# EAGLE design MTB-v2.0.0 (EAGLE 7.7.0)

## Sheet 1 of 3
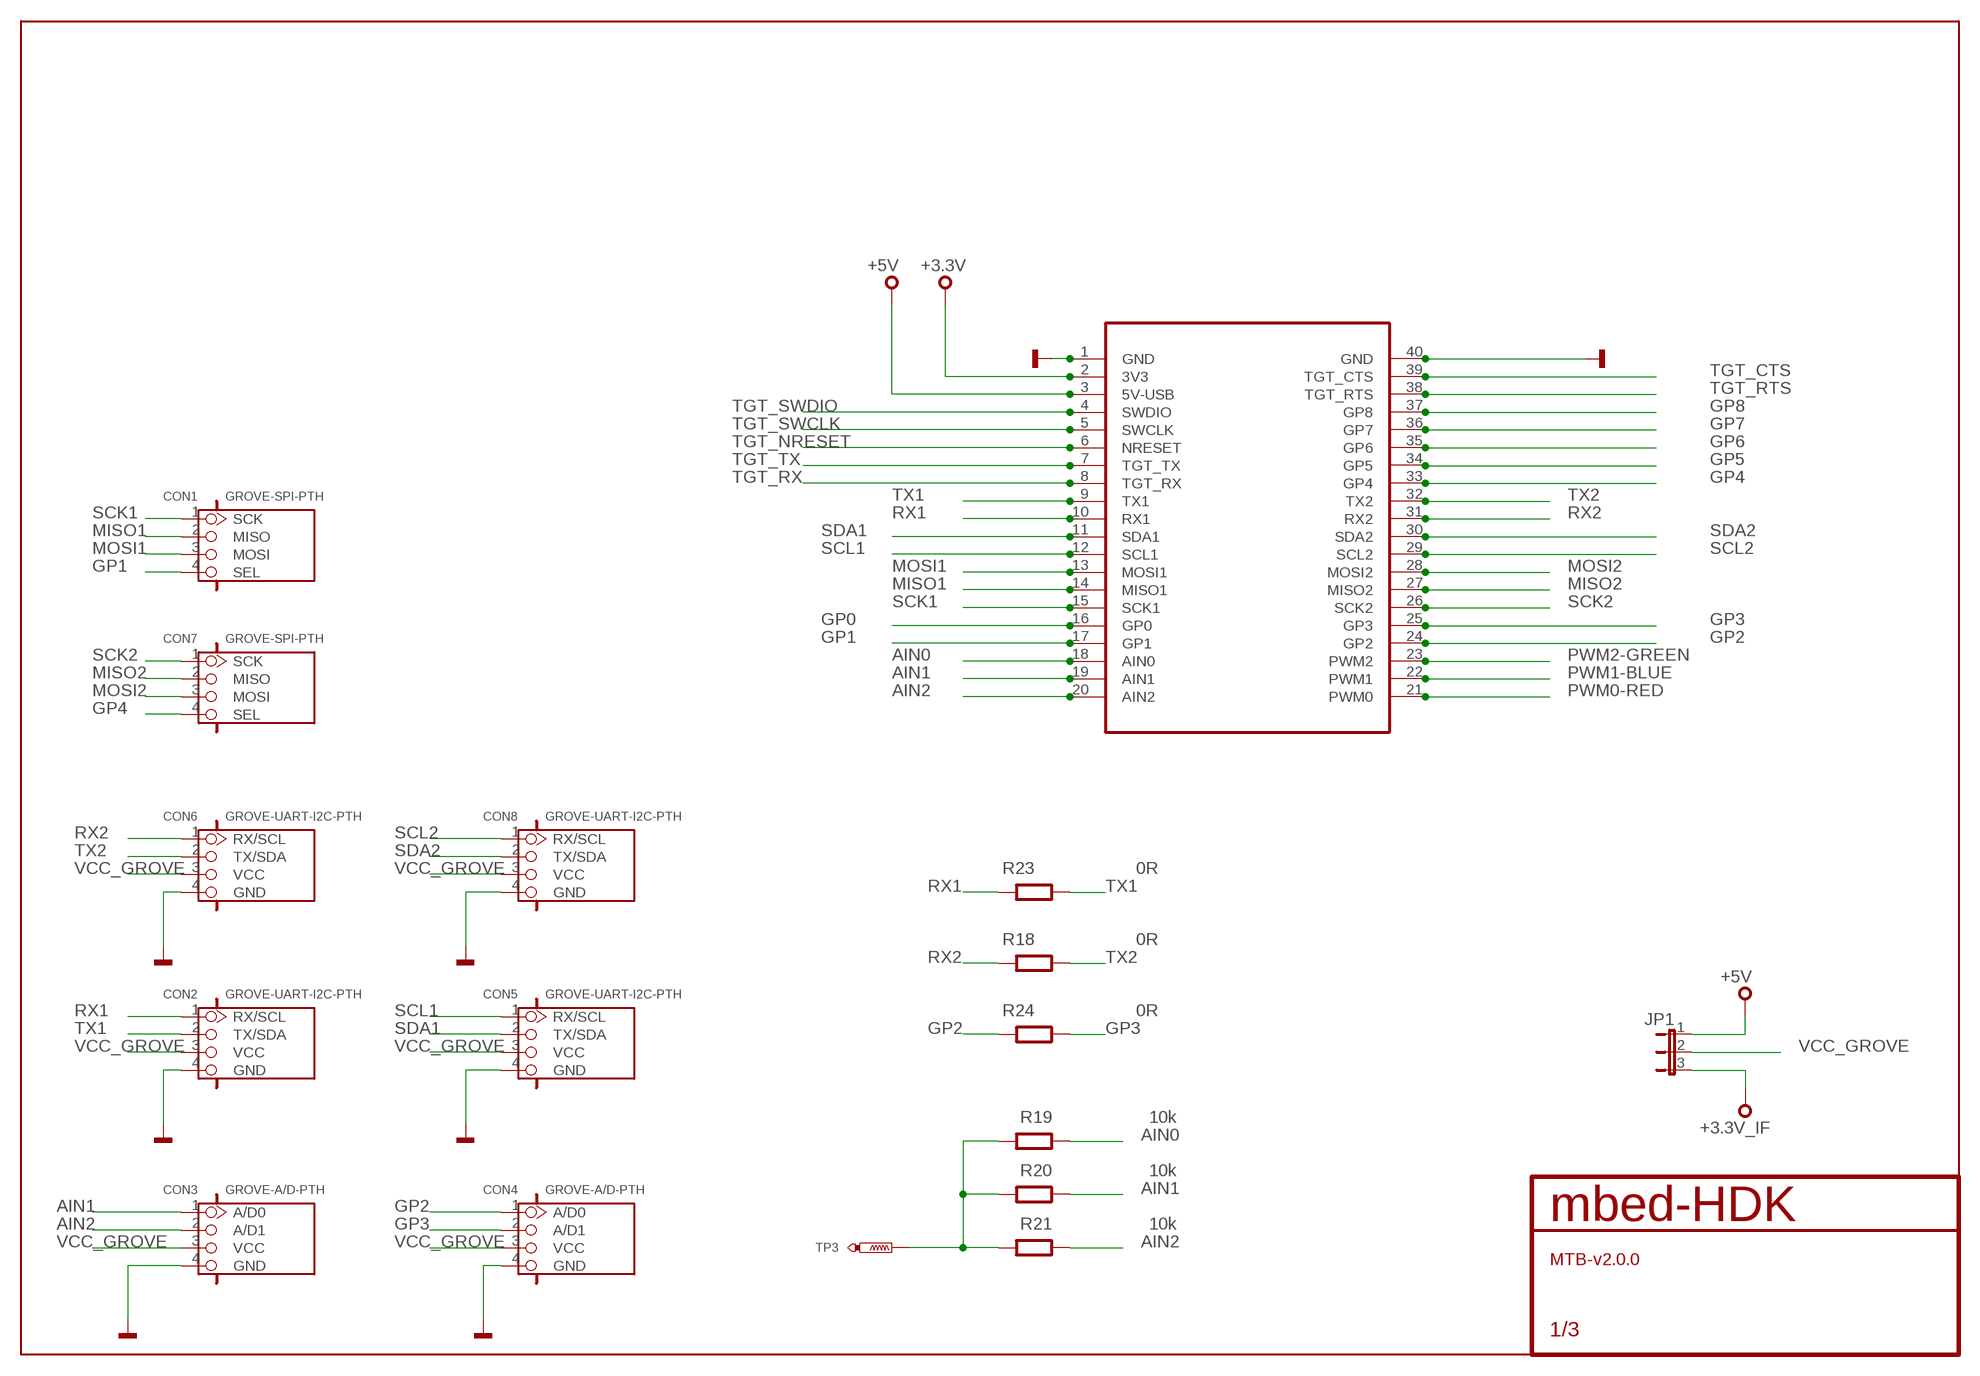
[diagram p0: schematic, sheet 1]

### Parts
CON1  GROVE-SPI-PTH  [HW4-2.0]
CON2  GROVE-UART-I2C-PTH  [HW4-2.0]
CON3  GROVE-A/D-PTH  [HW4-2.0]
CON4  GROVE-A/D-PTH  [HW4-2.0]
CON5  GROVE-UART-I2C-PTH  [HW4-2.0]
CON6  GROVE-UART-I2C-PTH  [HW4-2.0]
CON7  GROVE-SPI-PTH  [HW4-2.0]
CON8  GROVE-UART-I2C-PTH  [HW4-2.0]
JP1  JP2E  [JP2]
R18  0R  R0603  [0603@1]
R19  10k  R0603  [0603@1]
R20  10k  R0603  [0603@1]
R21  10k  R0603  [0603@1]
R23  0R  R0603  [0603@1]
R24  0R  R0603  [0603@1]
SKT1  MODULE_SOCKET  [MODULE_SOCKET]
TP3  TEST-POINT-50R-PTH  [TP50-PTH]

### Nets
+3.3V: SKT1.2(3V3) SKT1.P$42 ; also sheet 2
+3.3V_IF: JP1.3 ; also sheet 2,3
+5V: JP1.1 SKT1.3(5V-USB) SKT1.P$43 ; also sheet 2
AIN0: R19.1 SKT1.18(AIN0) SKT1.P$58 ; also sheet 3
AIN1: CON3.1(A/D0) R20.1 SKT1.19(AIN1) SKT1.P$59
AIN2: CON3.2(A/D1) R21.1 SKT1.20(AIN2) SKT1.P$60
GND: CON2.4(GND) CON3.4(GND) CON4.4(GND) CON5.4(GND) CON6.4(GND) CON8.4(GND) SKT1.1(GND) SKT1.40(GND) SKT1.P$41 SKT1.P$80 ; also sheet 2,3
GP0: SKT1.16(GP0) SKT1.P$56 ; also sheet 3
GP1: CON1.4(SEL) SKT1.17(GP1) SKT1.P$57
GP2: CON4.1(A/D0) R24.2 SKT1.24(GP2) SKT1.P$64 ; also sheet 3
GP3: CON4.2(A/D1) R24.1 SKT1.25(GP3) SKT1.P$65
GP4: CON7.4(SEL) SKT1.33(GP4) SKT1.P$73
GP5: SKT1.34(GP5) SKT1.P$74 ; also sheet 3
GP6: SKT1.35(GP6) SKT1.P$75 ; also sheet 3
GP7: SKT1.36(GP7) SKT1.P$76 ; also sheet 3
GP8: SKT1.37(GP8) SKT1.P$77
MISO1: CON1.2(MISO) SKT1.14(MISO1) SKT1.P$54 ; also sheet 3
MISO2: CON7.2(MISO) SKT1.27(MISO2) SKT1.P$67
MOSI1: CON1.3(MOSI) SKT1.13(MOSI1) SKT1.P$53 ; also sheet 3
MOSI2: CON7.3(MOSI) SKT1.28(MOSI2) SKT1.P$68
N$24: R19.2 R20.2 R21.2 TP3.TP
PWM0-RED: SKT1.21(PWM0) SKT1.P$61 ; also sheet 3
PWM1-BLUE: SKT1.22(PWM1) SKT1.P$62 ; also sheet 3
PWM2-GREEN: SKT1.23(PWM2) SKT1.P$63 ; also sheet 3
RX1: CON2.1(RX/SCL) R23.2 SKT1.10(RX1) SKT1.P$50
RX2: CON6.1(RX/SCL) R18.2 SKT1.31(RX2) SKT1.P$71
SCK1: CON1.1(SCK) SKT1.15(SCK1) SKT1.P$55 ; also sheet 3
SCK2: CON7.1(SCK) SKT1.26(SCK2) SKT1.P$66
SCL1: CON5.1(RX/SCL) SKT1.12(SCL1) SKT1.P$52 ; also sheet 3
SCL2: CON8.1(RX/SCL) SKT1.29(SCL2) SKT1.P$69 ; also sheet 3
SDA1: CON5.2(TX/SDA) SKT1.11(SDA1) SKT1.P$51 ; also sheet 3
SDA2: CON8.2(TX/SDA) SKT1.30(SDA2) SKT1.P$70 ; also sheet 3
TGT_CTS: SKT1.39(TGT_CTS) SKT1.P$79 ; also sheet 2
TGT_NRESET: SKT1.6(NRESET) SKT1.P$46 ; also sheet 2
TGT_RTS: SKT1.38(TGT_RTS) SKT1.P$78 ; also sheet 2
TGT_RX: SKT1.8(TGT_RX) SKT1.P$48 ; also sheet 2
TGT_SWCLK: SKT1.5(SWCLK) SKT1.P$45 ; also sheet 2
TGT_SWDIO: SKT1.4(SWDIO) SKT1.P$44 ; also sheet 2
TGT_TX: SKT1.7(TGT_TX) SKT1.P$47 ; also sheet 2
TX1: CON2.2(TX/SDA) R23.1 SKT1.9(TX1) SKT1.P$49
TX2: CON6.2(TX/SDA) R18.1 SKT1.32(TX2) SKT1.P$72
VCC_GROVE: CON2.3(VCC) CON3.3(VCC) CON4.3(VCC) CON5.3(VCC) CON6.3(VCC) CON8.3(VCC) JP1.2

## Sheet 2 of 3
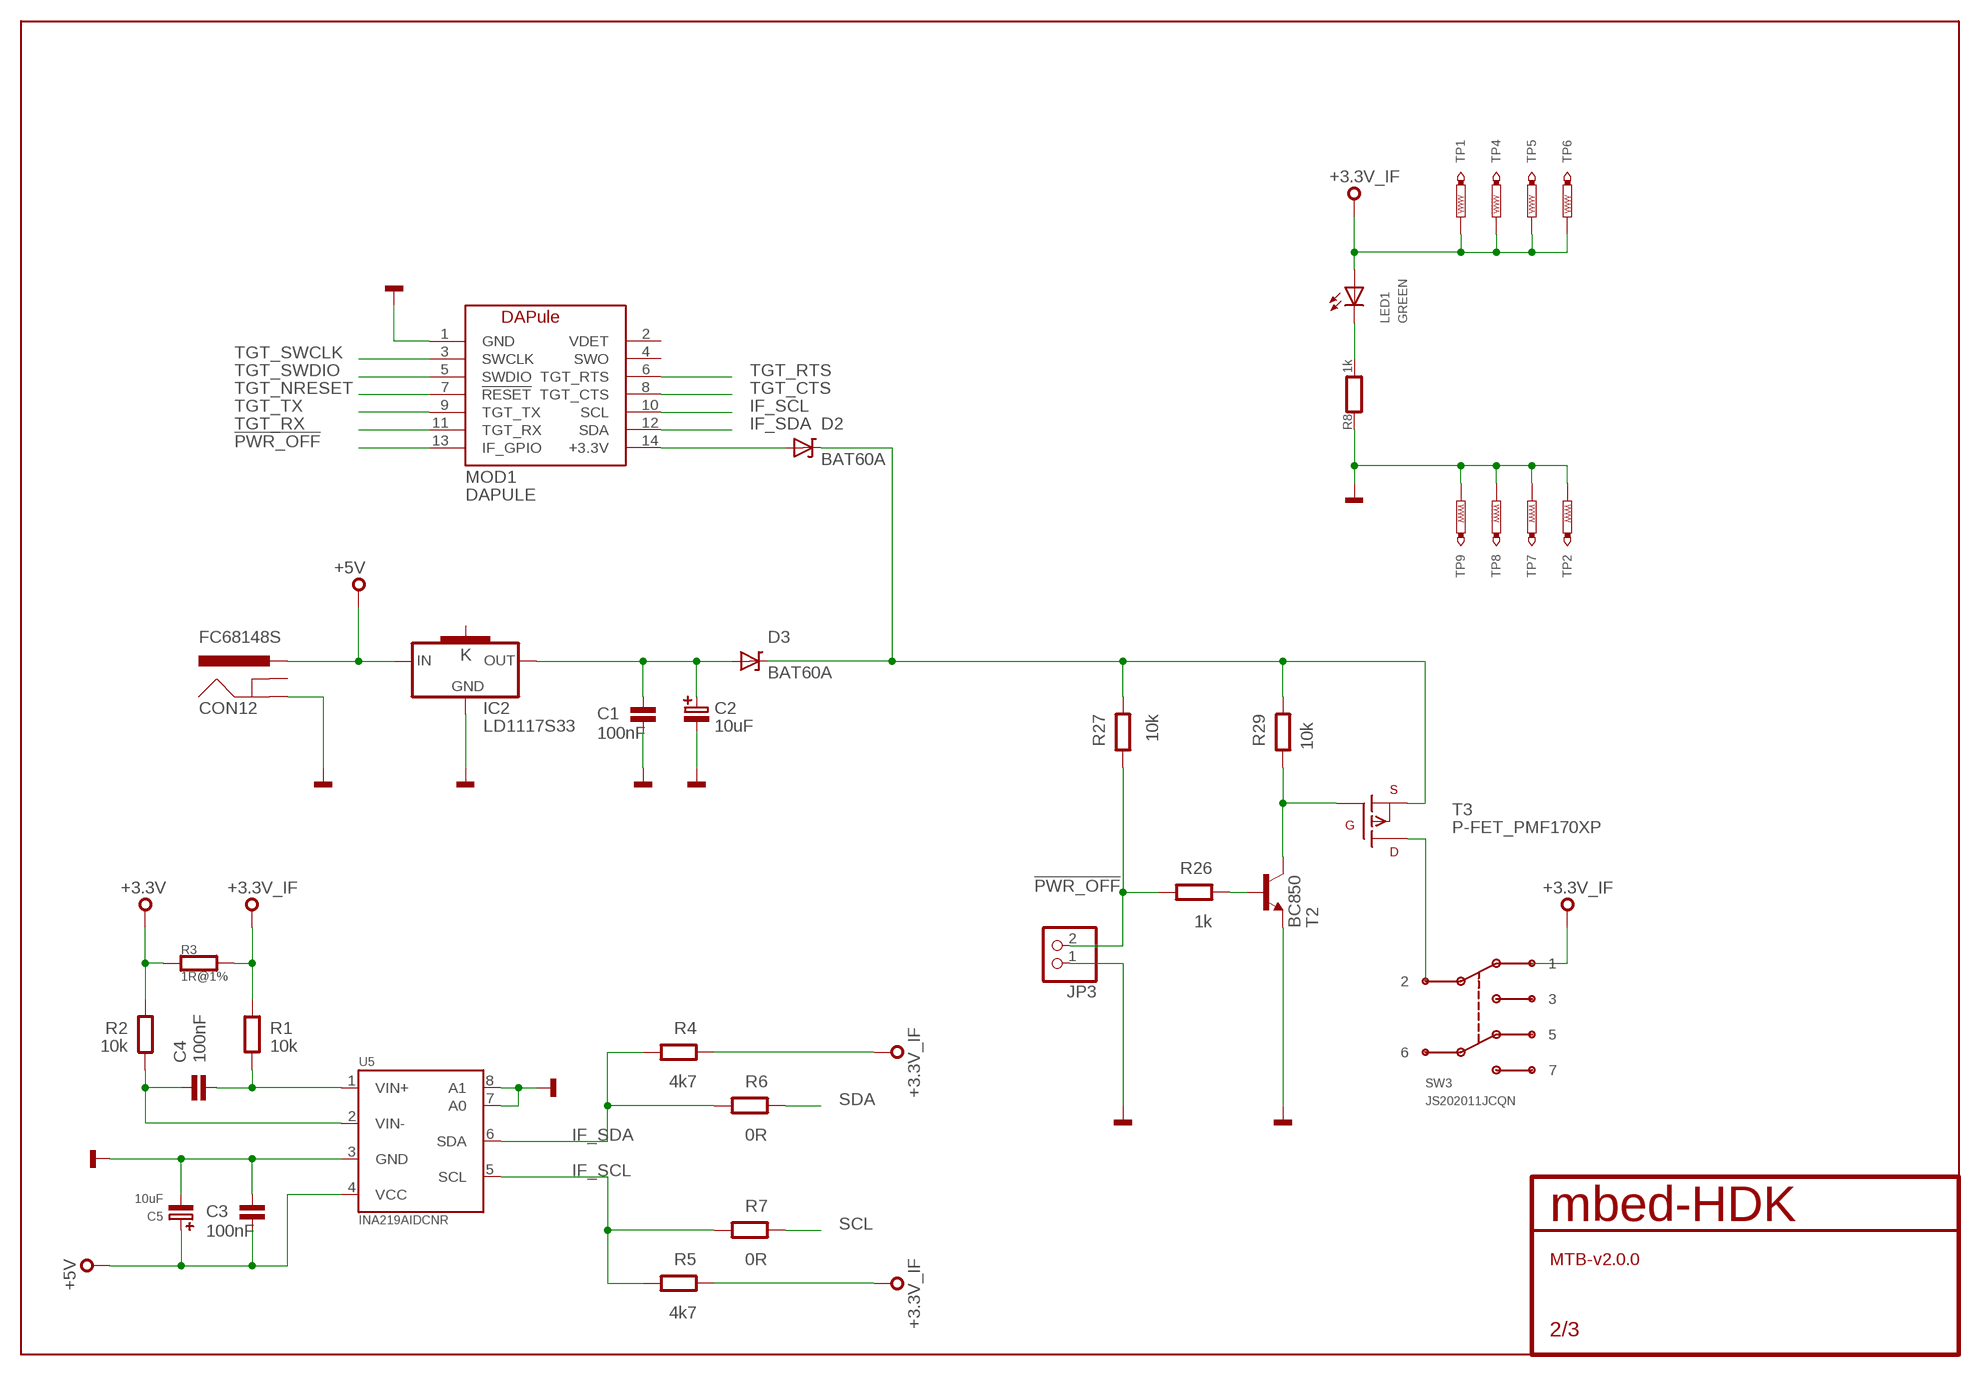
[diagram p1: schematic, sheet 2]

### Parts
C1  100nF  C0603  [0603]
C2  10uF  C-POLB  [SMC_B]
C3  100nF  C0603  [0603]
C4  100nF  C0603  [0603]
C5  10uF  C-POLA  [SMC_A]
CON12  FC68148S  [FC68148S]
D2  BAT60A  [SOD323]
D3  BAT60A  [SOD323]
IC2  LD1117S33  [SOT223]
JP3  PINHD-1X2  [1X02]
LED1  GREEN  SMD_LED0603  [CHIPLED_0603]
MOD1  DAPULE  [DAPULE]
R1  10k  R0603  [0603@1]
R2  10k  R0603  [0603@1]
R3  1R@1%  R0603  [0603]
R4  4k7  R0603  [0603@1]
R5  4k7  R0603  [0603@1]
R6  0R  R0603  [0603@1]
R7  0R  R0603  [0603@1]
R8  1k  RESISTOR0603  [0603]
R26  1k  R0603  [0603@1]
R27  10k  R0603  [0603@1]
R29  10k  R0603  [0603@1]
SW3  JS202011JCQN  [JS202011JCQN]
T2  BC850  [SOT23]
T3  P-FET_PMF170XP  [SOT23-BEC]
TP1  TEST-POINT-50R-PTH  [TP50-PTH]
TP2  TEST-POINT-50R-PTH  [TP50-PTH]
TP4  TEST-POINT-50R-PTH  [TP50-PTH]
TP5  TEST-POINT-50R-PTH  [TP50-PTH]
TP6  TEST-POINT-50R-PTH  [TP50-PTH]
TP7  TEST-POINT-50R-PTH  [TP50-PTH]
TP8  TEST-POINT-50R-PTH  [TP50-PTH]
TP9  TEST-POINT-50R-PTH  [TP50-PTH]
U5  INA219AIDCNR  [SOT23-8]

### Nets
!PWR_OFF: JP3.2 MOD1.13(IF_GPIO) R26.2 R27.2
+3.3V: R2.2 R3.1 ; also sheet 1
+3.3V_IF: LED1.A R1.2 R3.2 R4.1 R5.1 SW3.1 TP1.TP TP4.TP TP5.TP TP6.TP ; also sheet 1,3
+5V: C3.2 C5.+ CON12.1-1(PWR) CON12.1-2(PWR) IC2.3(IN) U5.4(VCC) ; also sheet 1
GND: C1.2 C2.- C3.1 C5.- CON12.3(GND) IC2.1(GND) JP3.1 MOD1.1(GND) R8.1 T2.2(E) TP2.TP TP7.TP TP8.TP TP9.TP U5.3(GND) U5.7(A0) U5.8(A1) ; also sheet 1,3
IF_SCL: MOD1.10(SCL) R5.2 R7.2 U5.5(SCL)
IF_SDA: MOD1.12(SDA) R4.2 R6.2 U5.6(SDA)
N$1: C4.2 R2.1 U5.2(VIN-)
N$2: C4.1 R1.1 U5.1(VIN+)
N$10: D2.A MOD1.14(+3.3V)
N$13: C1.1 C2.+ D3.A IC2.2(OUT)
N$14: D2.K D3.K R27.1 R29.1 T3.E(S)
N$28: R26.1 T2.1(B)
N$29: SW3.2 T3.C(D)
N$32: R29.2 T2.3(C) T3.B(G)
PA_1: LED1.C R8.2
SCL: R7.1 ; also sheet 3
SDA: R6.1 ; also sheet 3
TGT_CTS: MOD1.8(TGT_CTS) ; also sheet 1
TGT_NRESET: MOD1.7(!RESET) ; also sheet 1
TGT_RTS: MOD1.6(TGT_RTS) ; also sheet 1
TGT_RX: MOD1.11(TGT_RX) ; also sheet 1
TGT_SWCLK: MOD1.3(SWCLK) ; also sheet 1
TGT_SWDIO: MOD1.5(SWDIO) ; also sheet 1
TGT_TX: MOD1.9(TGT_TX) ; also sheet 1
Unconnected: CON12.2(GNDBREAK) IC2.4(K) MOD1.2(VDET) MOD1.4(SWO) SW3.3 SW3.5 SW3.6 SW3.7

## Sheet 3 of 3
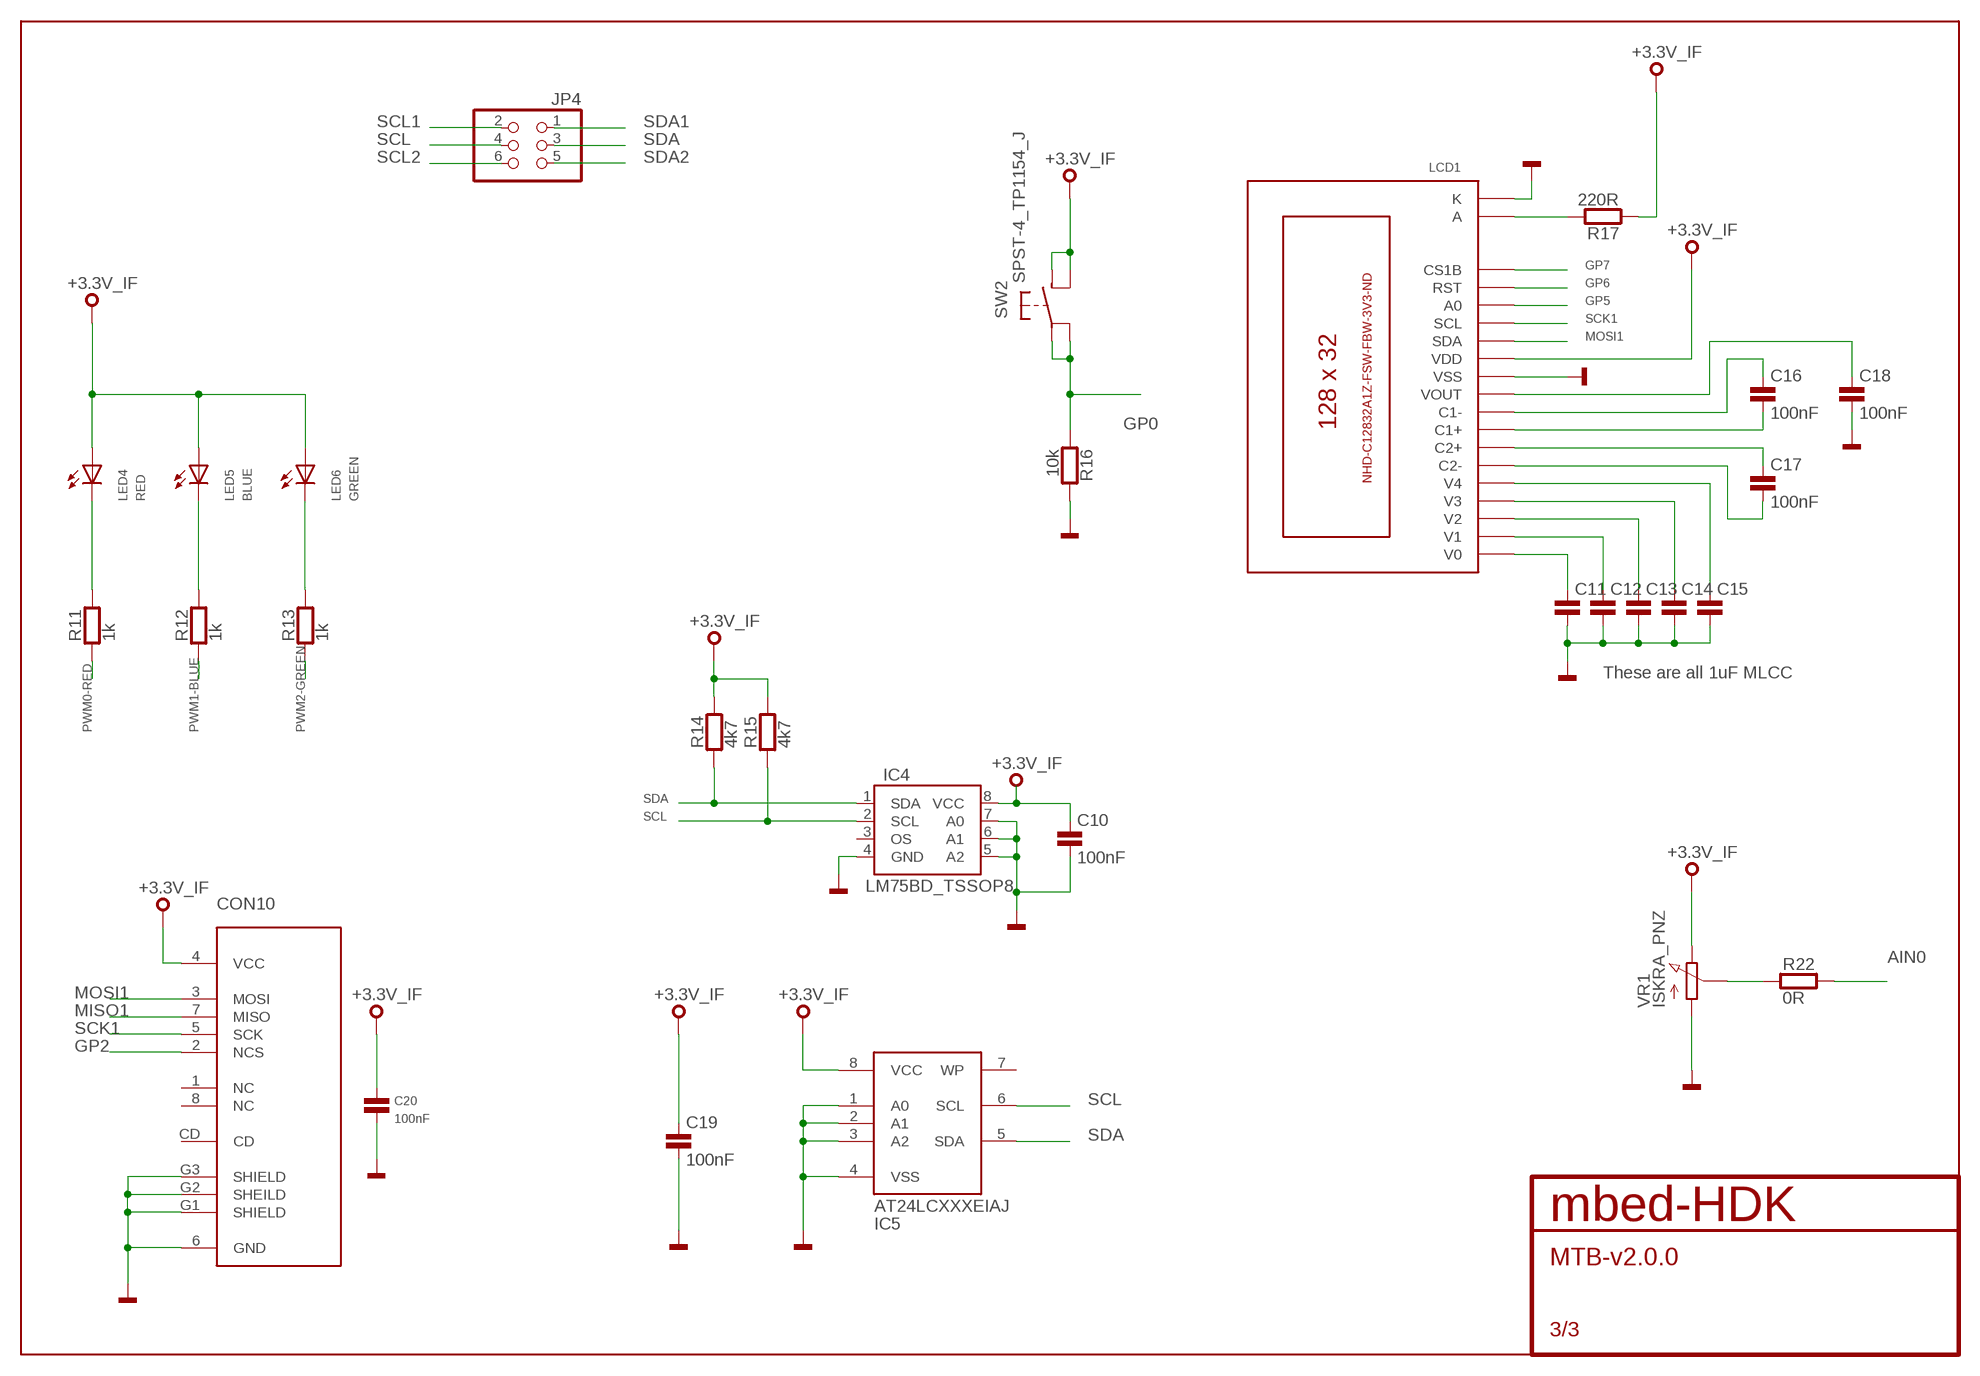
[diagram p2: schematic, sheet 3]

### Parts
C10  100nF  C0603  [0603]
C11  100nF  C0603  [0603]
C12  100nF  C0603  [0603]
C13  100nF  C0603  [0603]
C14  100nF  C0603  [0603]
C15  100nF  C0603  [0603]
C16  100nF  C0603  [0603]
C17  100nF  C0603  [0603]
C18  100nF  C0603  [0603]
C19  100nF  C0603  [0603]
C20  100nF  C0603  [0603]
CON10  MICRO-SD  [AMPHENOL-101-00660-68-6]
IC4  LM75BD_TSSOP8  [TSSOP8]
IC5  AT24LCXXXEIAJ  [SO08-EIAJ]
JP4  PINHD-2X3  [2X03]
LCD1  C12832A1Z  [C12832A1Z]
LED4  RED  LED0603  [CHIPLED_0603]
LED5  BLUE  LED0603  [CHIPLED_0603]
LED6  GREEN  LED0603  [CHIPLED_0603]
R11  1k  R0603  [0603]
R12  1k  R0603  [0603]
R13  1k  R0603  [0603]
R14  4k7  R0603  [0603]
R15  4k7  R0603  [0603]
R16  10k  R0603  [0603]
R17  220R  R0603  [0603]
R22  0R  R0603  [0603]
SW2  SPST-4_TP1154_J  [TP-1154X]
VR1  ISKRA_PNZ  [CA14V]

### Nets
+3.3V_IF: C10.1 C19.1 C20.1 CON10.4(VCC) IC4.8(VCC) IC5.8(VCC) LCD1.P$12(VDD) LED4.A LED5.A LED6.A R14.2 R15.2 R17.1 SW2.B1 SW2.B2 VR1.P$3(E) ; also sheet 1,2
AIN0: R22.2 ; also sheet 1
GND: C10.2 C11.2 C12.2 C13.2 C14.2 C15.2 C18.2 C19.2 C20.2 CON10.6(GND) CON10.G1(SHIELD) CON10.G2(SHEILD) CON10.G3(SHIELD) IC4.4(GND) IC4.5(A2) IC4.6(A1) IC4.7(A0) IC5.1(A0) IC5.2(A1) IC5.3(A2) IC5.4(VSS) LCD1.K LCD1.P$11(VSS) R16.2 VR1.P$1(A) ; also sheet 1,2
GP0: R16.1 SW2.A1 SW2.A2 ; also sheet 1
GP2: CON10.2(NCS) ; also sheet 1
GP5: LCD1.P$15(A0) ; also sheet 1
GP6: LCD1.P$16(RST) ; also sheet 1
GP7: LCD1.P$17(CS1B) ; also sheet 1
MISO1: CON10.7(MISO) ; also sheet 1
MOSI1: CON10.3(MOSI) LCD1.P$13(SDA) ; also sheet 1
N$3: C16.1 LCD1.P$9(C1-)
N$4: C17.1 LCD1.P$7(C2+)
N$5: C17.2 LCD1.P$6(C2-)
N$8: C16.2 LCD1.P$8(C1+)
N$11: C11.1 LCD1.P$1(V0)
N$12: C12.1 LCD1.P$2(V1)
N$15: C13.1 LCD1.P$3(V2)
N$16: C14.1 LCD1.P$4(V3)
N$17: C15.1 LCD1.P$5(V4)
N$18: C18.1 LCD1.P$10(VOUT)
N$19: LED4.C R11.2
N$20: LED6.C R13.2
N$21: LED5.C R12.2
N$22: LCD1.A R17.2
N$25: R22.1 VR1.P$2(S)
PWM0-RED: R11.1 ; also sheet 1
PWM1-BLUE: R12.1 ; also sheet 1
PWM2-GREEN: R13.1 ; also sheet 1
SCK1: CON10.5(SCK) LCD1.P$14(SCL) ; also sheet 1
SCL: IC4.2(SCL) IC5.6(SCL) JP4.4 R15.1 ; also sheet 2
SCL1: JP4.2 ; also sheet 1
SCL2: JP4.6 ; also sheet 1
SDA: IC4.1(SDA) IC5.5(SDA) JP4.3 R14.1 ; also sheet 2
SDA1: JP4.1 ; also sheet 1
SDA2: JP4.5 ; also sheet 1
Unconnected: CON10.1(NC) CON10.8(NC) CON10.CD IC4.3(OS) IC5.7(WP)

### Notes on the sheet
- These are all 1uF MLCC

## Library data of the parts
C1 C3 C4 C20 = mbed-HDK:C: Capacitor
C2 = mbed-HDK:C-POL: Polarised capacitor
C5 = mbed-HDK-RLC:C-POL: Polarised capacitor
C10-C19 = mbed-rlcq:C
CON1 CON7 = Treadstone:GROVE-SPI-PTH
CON2 CON5 CON6 CON8 = Treadstone:GROVE-UART-I2C-PTH
CON3 CON4 = Treadstone:GROVE-A/D-PTH
CON10 = mbed-HDK:MICRO-SD
CON12 = blackbriar:FC68148S: Power Jack This is the standard 5.5mm barrel jack for power. The PTH is the most common, proven, reliable, footprint. The Slot footprint only works if the mill layer is transmitted to the PCB fab house so be warned. Mating wall wart : TOL-00298 (and others)
D2 D3 = mbed-HDK-Transistor:BAT60A: SCHOTTKY DIODE; MF: Infineon; MFN: BAT60AE6327HTSA1; OC-DIGIKEY: BAT60AE6327HTSA1CT-ND; OC-MOUSER: 726-BAT60AE6327; OC-NEWARK: 85X4127
IC2 = mbed-HDK:LD1117S33: VOLTAGE REGULATOR SMD 3,3V
IC4 = LabBoard:LM75BD
IC5 = mbed-HDK:AT24LCXXX: I2C EEPROM, 24LC family
JP1 = Treadstone:JP2E: JUMPER
JP3 = pinhead:PINHD-1X2: PIN HEADER
JP4 = pinhead:PINHD-2X3: PIN HEADER
LCD1 = LabBoard:C12832A1Z
LED1 = mbed-HDK-Optical:SMD_LED: LED SMD, Colour Red; MF: Wurth Electronics Inc; MFN: 150060RS75000; OC-DIGIKEY: 732-4978-1-ND; OC-MOUSER: 710-150060RS75000; OC-NEWARK: 2322071
LED4-LED6 = mbed-HDK:LED: SMD LED
MOD1 = mbed-HDK-misc-Board:DAPULE
R1 R2 R4-R7 R18-R21 R23 R24 R26 R27 R29 = mbed-HDK:R
R3 = mbed-HDK-RLC:R: Resistor
R8 = mbed-HDK-RLC:RESISTOR: Resistor
R11-R17 R22 = mbed-rlcq:R
SKT1 = Treadstone:MODULE_SOCKET
SW2 = mbed-HDK:SPST-4
SW3 = mbed-HDK-Switch:JS202011JCQN: SLIDE TOGGLE SWITCH VERTICAL (DPDT); MF: C&K Components; MFN: JS202011JCQN; OC-DIGIKEY: CKN10723CT-ND; OC-MOUSER: 611-JS202011JCQN
T2 = mbed-HDK:BC850: NPN TRANSISTOR
T3 = Karasouli:P-FET
TP1-TP9 = mbed-HDK:TEST-POINT
U5 = mbed-HDK-IC:INA219AIDCNR: Current Sense - I2C Bi-Directional CURRENT/POWER MONITOR with I2C Interface; MF: Texas Instruments; MFN: INA219AIDCNR; OC-DIGIKEY: 296-23770-1-ND; OC-MOUSER: 595-INA219AIDCNR; OC-NEWARK: 2295989
VR1 = LabBoard:ISKRA_PNZ

## Board
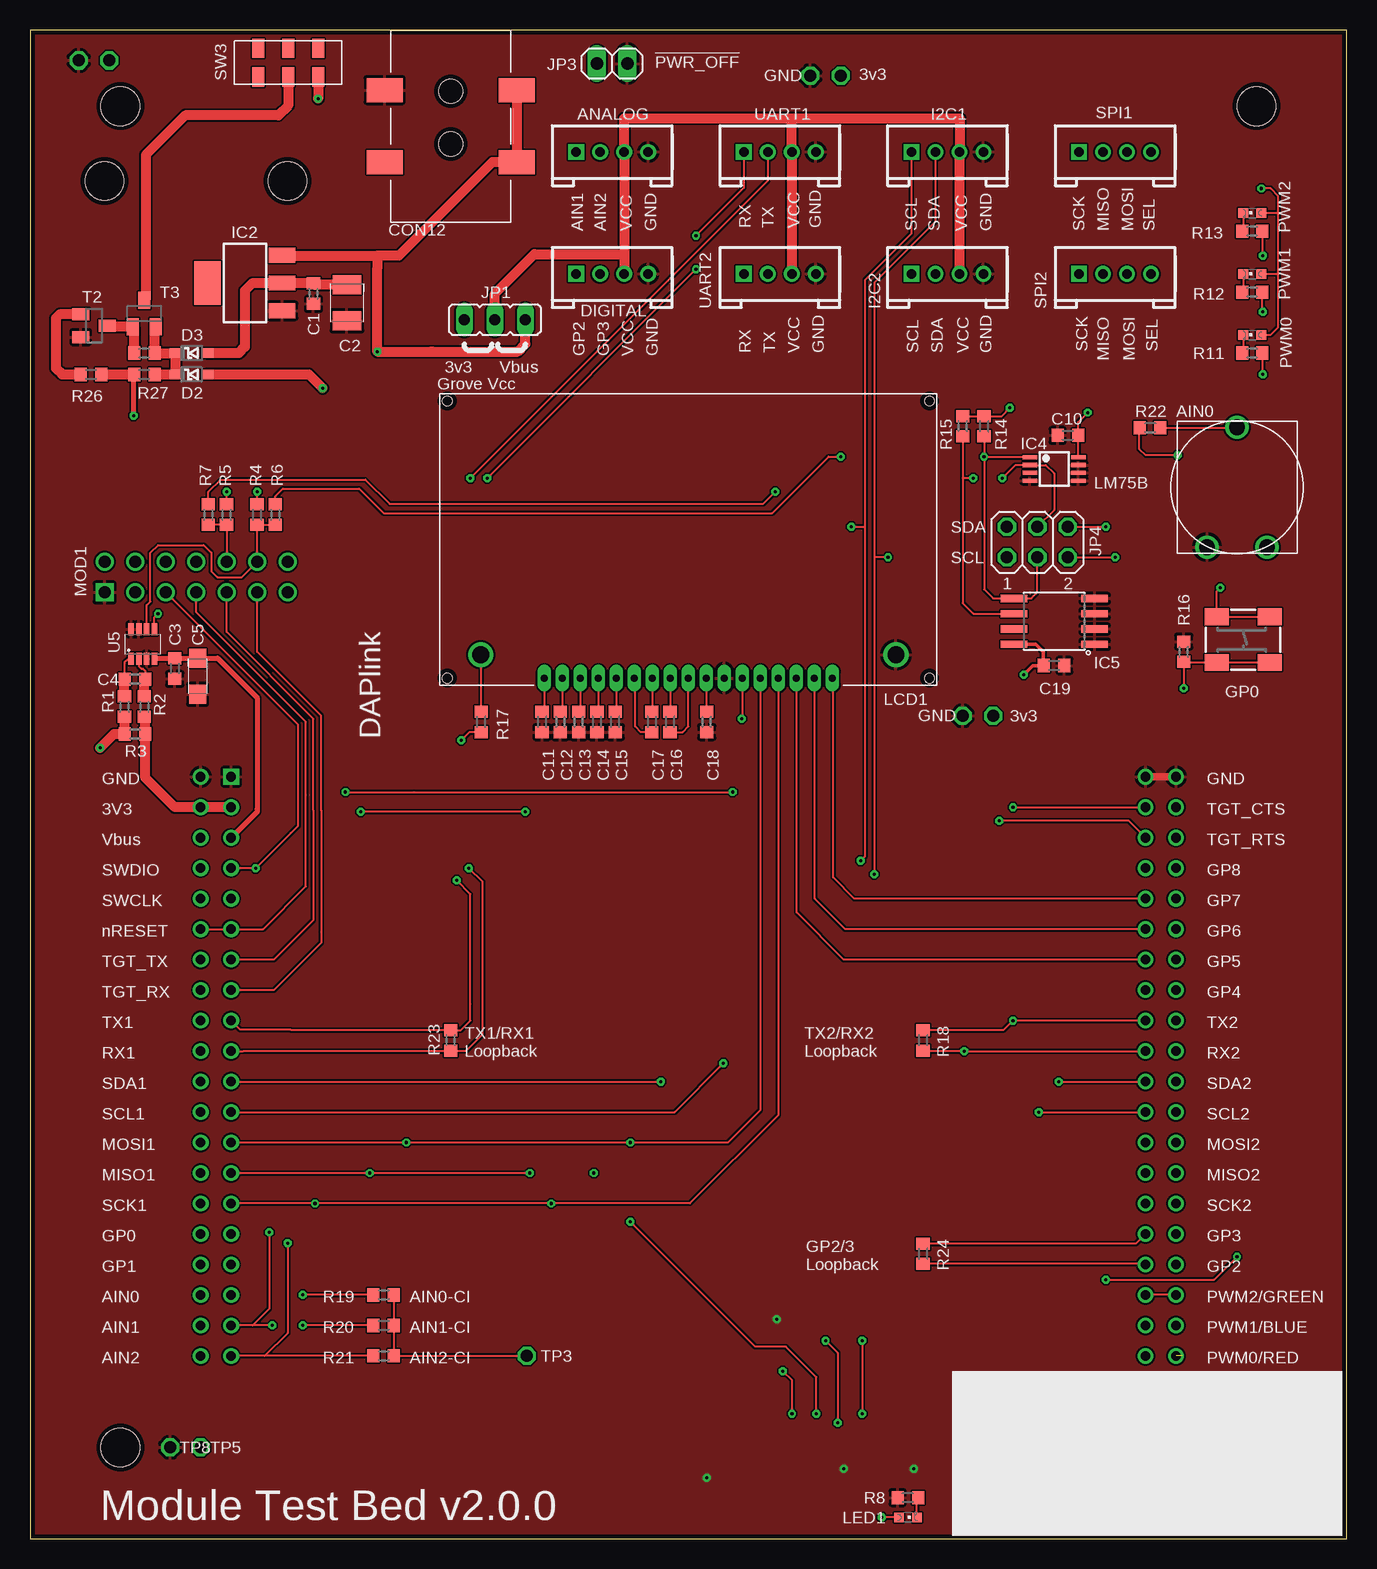
[diagram p3: board, top side]
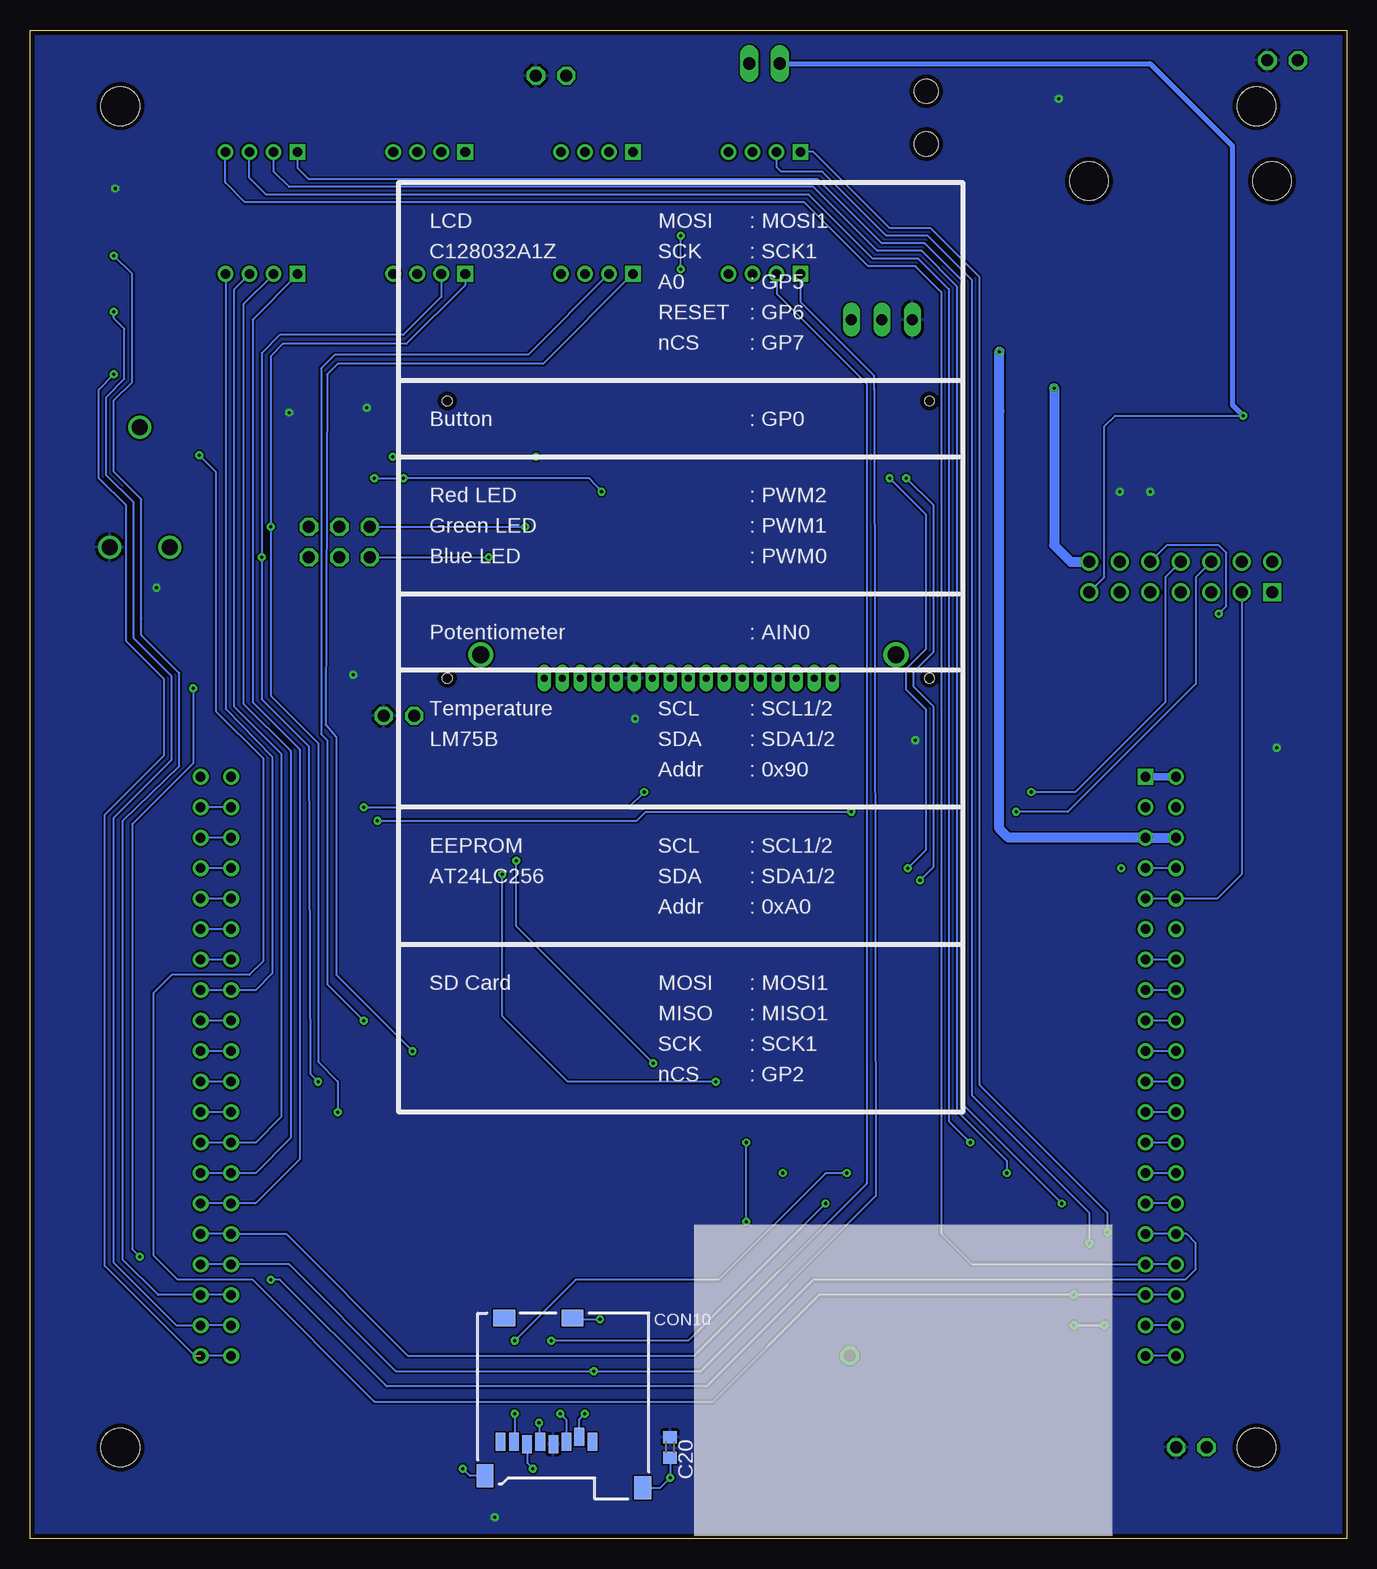
[diagram p4: board, bottom side, seen from below]

Size 109.73 x 125.73 mm. Coordinates in mm from the lower left corner, seen from the top.
Outline: 0,0 109.73,0 109.73,125.73 0,125.73 0,0
Copper layers ((1*16)): Top 0.035mm / dielectric 0.8mm / Bottom 0.035mm
Design rules "mbed-HDK-6-6-2-layer": minimum track width 6mil, minimum drill 9mil, track to track 6mil, track to pad 6mil, pad to pad 6mil, via to via 6mil, smd to smd 6mil, copper to edge 15mil, drill to drill 8mil, minimum pad ring 10mil, minimum via ring 8mil, stop-mask expansion 4mil, vias tented up to drill 0mil, thermal gap 10mil
Holes 3.2 mm at 7.52,7.62 7.52,119.38 102.2,7.62 102.2,119.38

### Footprints (pad centres in the part's own frame; a part is rotated, then mirrored left to right if it is on the bottom)
0603 = smd 1 x 1.1: 1 -0.85,0; 2 0.85,0
SMC_B = smd 1.6 x 2.4: + -1.5,0; - 1.5,0
SMC_A = smd 1.6 x 1.4: + -1.5,0; - 1.5,0
HW4-2.0 = drill 0.8 pad 1.27 square: 1 -3,0 | drill 0.8 pad 1.27: 2 -1,0; 3 1,0; 4 3,0
AMPHENOL-101-00660-68-6 = smd 0.8 x 1.5: 1 -2.55,10.7; 2 -1.45,10.3; 3 -0.4,10.7; 4 0.7,10.9; 5 1.8,10.7; 6 2.9,10.9; 7 4,10.7; 8 5.1,10.7 | smd 1.8 x 1.4: CD 4.8,0.4; G1 -0.9,0.4 | smd 1.4 x 1.9: G2 6.4,13.55; G3 -6.75,14.55
FC68148S = smd 3 x 2: 1-1 5.5,-5; 1-2 5.5,-11; 2 -5.5,-11; 3 -5.5,-5 | hole 2: 0,-5.1; 0,-9.5
SOD323 = smd 1 x 0.8: A 1.3,0; K -1.3,0
SOT223 = smd 1.219 x 2.235: 1 -2.311,-3.099; 2 0,-3.099; 3 2.311,-3.099 | smd 3.6 x 2.2: 4 0,3.099
TSSOP8 = smd 1.2 x 0.35: 1 -2.025,0.975; 2 -2.025,0.325; 3 -2.025,-0.325; 4 -2.025,-0.975; 5 2.025,-0.975; 6 2.025,-0.325; 7 2.025,0.325; 8 2.025,0.975
SO08-EIAJ = smd 0.61 x 2.21: 1 -1.905,-3.378; 2 -0.635,-3.378; 3 0.635,-3.378; 4 1.905,-3.378; 5 1.905,3.353; 6 0.635,3.353; 7 -0.635,3.353; 8 -1.905,3.353
JP2 = drill 0.914 long: 1 -2.54,0; 2 0,0; 3 2.54,0
1X02 = drill 1.016 long: 1 -1.27,0; 2 1.27,0
2X03 = drill 1.016 octagon: 1 -2.54,-1.27; 2 -2.54,1.27; 3 0,-1.27; 4 0,1.27; 5 2.54,-1.27; 6 2.54,1.27
C12832A1Z = drill 1.4: A 3.4,2.55; K 38,2.55 | drill 0.6 long: P$1 8.7,0.6; P$2 10.2,0.6; P$3 11.7,0.6; P$4 13.2,0.6; P$5 14.7,0.6; P$6 16.2,0.6; P$7 17.7,0.6; P$8 19.2,0.6; P$9 20.7,0.6; P$10 22.2,0.6; P$11 23.7,0.6; P$12 25.2,0.6; P$13 26.7,0.6; P$14 28.2,0.6; P$15 29.7,0.6; P$16 31.2,0.6; P$17 32.7,0.6 | hole 0.8: 0.6,0.6; 40.8,0.6; 40.8,23.7; 0.6,23.7
CHIPLED_0603 = smd 0.8 x 0.8: A 0,-0.75; C 0,0.75
DAPULE = drill 1 square: 1 36.83,-7.62 | drill 1: 2 34.29,-7.62; 3 36.83,-5.08; 4 34.29,-5.08; 5 36.83,-2.54; 6 34.29,-2.54; 7 36.83,0; 8 34.29,0; 9 36.83,2.54; 10 34.29,2.54; 11 36.83,5.08; 12 34.29,5.08; 13 36.83,7.62; 14 34.29,7.62 | hole 3.2: 2.54,7.62; 2.54,-7.62
0603@1 = smd 1 x 1.1: 1 -0.85,0; 2 0.85,0
MODULE_SOCKET = drill 0.8 square: 1 0,0 | drill 0.8: 2 0,-2.54; 3 0,-5.08; 4 0,-7.62; 5 0,-10.16; 6 0,-12.7; 7 0,-15.24; 8 0,-17.78; 9 0,-20.32; 10 0,-22.86; 11 0,-25.4; 12 0,-27.94; 13 0,-30.48; 14 0,-33.02; 15 0,-35.56; 16 0,-38.1; 17 0,-40.64; 18 0,-43.18; 19 0,-45.72; 20 0,-48.26; 21 76.2,-48.26; 22 76.2,-45.72; 23 76.2,-43.18; 24 76.2,-40.64; 25 76.2,-38.1; 26 76.2,-35.56; 27 76.2,-33.02; 28 76.2,-30.48; 29 76.2,-27.94; 30 76.2,-25.4; 31 76.2,-22.86; 32 76.2,-20.32; 33 76.2,-17.78; 34 76.2,-15.24; 35 76.2,-12.7; 36 76.2,-10.16; 37 76.2,-7.62; 38 76.2,-5.08; 39 76.2,-2.54; 40 76.2,0; P$41 -2.54,0; P$42 -2.54,-2.54; P$43 -2.54,-5.08; P$44 -2.54,-7.62; P$45 -2.54,-10.16; P$46 -2.54,-12.7; P$47 -2.54,-15.24; P$48 -2.54,-17.78; P$49 -2.54,-20.32; P$50 -2.54,-22.86; P$51 -2.54,-25.4; P$52 -2.54,-27.94; P$53 -2.54,-30.48; P$54 -2.54,-33.02; P$55 -2.54,-35.56; P$56 -2.54,-38.1; P$57 -2.54,-40.64; P$58 -2.54,-43.18; P$59 -2.54,-45.72; P$60 -2.54,-48.26; P$61 78.74,-48.26; P$62 78.74,-45.72; P$63 78.74,-43.18; P$64 78.74,-40.64; P$65 78.74,-38.1; P$66 78.74,-35.56; P$67 78.74,-33.02; P$68 78.74,-30.48; P$69 78.74,-27.94; P$70 78.74,-25.4; P$71 78.74,-22.86; P$72 78.74,-20.32; P$73 78.74,-17.78; P$74 78.74,-15.24; P$75 78.74,-12.7; P$76 78.74,-10.16; P$77 78.74,-7.62; P$78 78.74,-5.08; P$79 78.74,-2.54; P$80 78.74,0
TP-1154X = smd 2 x 1.4: A1 -2.2,1.9; A2 2.2,1.9; B1 -2.2,-1.9; B2 2.2,-1.9
JS202011JCQN = smd 1 x 1.6: 1 0,2.4; 2 2.5,2.4; 3 5,2.4; 5 0,0; 6 2.5,0; 7 5,0
SOT23 = smd 1 x 1.4: 1 -0.95,-1.1; 2 0.95,-1.1; 3 0,1.1
SOT23-BEC = smd 1 x 1.4: B -0.95,-1.1; C 0,1.1; E 0.95,-1.1
TP50-PTH = drill 1 octagon: TP 0,0
SOT23-8 = smd 1 x 0.45: 1 -1.225,0.975; 2 -1.225,0.325; 3 -1.225,-0.325; 4 -1.225,-0.975; 5 1.225,-0.975; 6 1.225,-0.325; 7 1.225,0.325; 8 1.225,0.975
CA14V = drill 1.3: P$1 -2.5,-5; P$2 0,5; P$3 2.5,-5

### Placement (x,y rotation side)
C1  23.62,103.76 270 top
C2  26.42,103 270 top
C3  12.06,72.52 90 top
C4  8.76,71.63 0 top
C5  13.97,71.88 270 top
C10  86.49,91.95 180 top
C11  42.67,68.07 270 top
C12  44.2,68.07 270 top
C13  45.72,68.07 270 top
C14  47.24,68.07 270 top
C15  48.77,68.07 270 top
C16  53.34,68.07 90 top
C17  51.82,68.07 270 top
C18  56.39,68.07 270 top
C19  85.34,72.77 0 top
C20  56.39,7.62 270 bottom
CON1  90.42,115.57 0 top
CON2  62.48,115.57 0 top
CON3  48.51,115.57 0 top
CON4  48.51,105.41 0 top
CON5  76.45,115.57 0 top
CON6  62.48,105.41 0 top
CON7  90.42,105.41 0 top
CON8  76.45,105.41 0 top
CON10  65.41,18.8 180 bottom
CON12  35.05,125.73 0 top
D2  13.46,97.03 0 top
D3  13.46,98.81 0 top
IC2  17.91,104.65 90 top
IC4  85.34,89.15 0 top
IC5  85.34,76.45 90 top
JP1  38.73,101.6 180 top
JP3  48.51,122.94 180 top
JP4  83.95,83.06 0 top
LCD1  34.16,71.12 0 top
LED1  73.15,1.78 270 top
LED4  101.85,100.33 90 top
LED5  101.85,105.41 90 top
LED6  101.85,110.49 90 top
MOD1  13.84,115.7 270 top
R1  7.87,69.34 270 top
R2  9.52,69.34 270 top
R3  8.76,67.06 180 top
R4  18.92,85.34 270 top
R5  16.38,85.34 270 top
R6  20.45,85.34 270 top
R7  14.86,85.34 270 top
R8  73.15,3.43 0 top
R11  101.85,98.81 180 top
R12  101.85,103.89 180 top
R13  101.85,108.97 180 top
R14  79.5,92.71 90 top
R15  77.72,92.71 90 top
R16  96.14,73.91 90 top
R17  37.59,68.07 90 top
R18  74.42,41.53 270 top
R19  29.46,20.32 0 top
R20  29.46,17.78 0 top
R21  29.46,15.24 0 top
R22  93.34,92.58 180 top
R23  35.05,41.53 270 top
R24  74.42,23.75 270 top
R26  5.08,97.03 0 top
R27  9.52,97.03 180 top
R29  9.52,98.81 180 top
SKT1  16.76,63.5 0 top
SW2  101.09,74.93 180 top
SW3  24,124.21 180 top
T2  5.33,101.09 270 top
T3  9.52,102.11 0 top
TP1  67.56,121.92 90 top
TP2  65.02,121.92 90 top
TP3  41.4,15.24 0 top
TP4  80.26,68.58 0 top
TP5  14.22,7.62 0 top
TP6  6.6,123.19 0 top
TP7  77.72,68.58 0 top
TP8  11.68,7.62 0 top
TP9  4.06,123.19 0 top
U5  9.4,74.55 90 top
VR1  100.58,87.63 0 top

### Tracks (layer width: path | path; a pad name or v marks a point on that pad's centre or on a via)
!PWR_OFF  (via drill 0.25)
  Top 0.406: v8.64,93.6 8.64,96.99 R27.2
  Top 0.813: R26.2 R27.2
  Bottom 0.152: MOD1.13 20.19,80.14 20.19,83.06 20.19,92.71 19.3,93.6 v8.64,93.6
  Bottom 0.406: JP3.2 16.38,122.94 9.52,116.08 9.52,94.49 v8.64,93.6
+3.3V
  Top 0.813: SKT1.2 SKT1.P$42 12.06,60.96 9.65,63.37 9.61,63.41 R3.1 9.61,68.4 R2.2
+3.3V_IF  (via drill 0.25, 0.25 pad 0.25)
  Top 0.152: v99.19,79.25 98.89,78.95 SW2.B2 SW2.B1 | R17.1 36.61,67.22 v35.94,66.55 | LCD1.P$12 59.36,68.38 v59.31,68.33 | v88.14,93.85 87.34,93.05 C10.1 87.37,91.92 IC4.8 | R15.2 R14.2 80.99,93.56 v81.66,94.23 | LED4.A 103.38,100.33 104.01,100.97 104.01,105.41 | 104.01,105.41 104.01,110.49 | 104.01,110.49 104.01,111.89 103.38,112.52 v102.62,112.52 v102.6,112.51 | LED6.A 104.01,110.49 | LED5.A 104.01,105.41 | LED1.A v70.99,1.78 | R4.1 v18.92,87.25 | R5.1 v16.38,87.25
  Top 0.305: IC5.8 83.82,74.55 84.45,73.91 84.45,72.81 C19.1 83.57,72.77 v82.8,72.01
  Top 0.813: SW3.1 v24,120.02 | v5.84,65.91 6.98,67.06 R3.2 7.91,68.45 R1.2
  pour Bottom: 0,0 109.73,0 109.73,125.73 0,125.73
+5V  (via drill 0.25 pad 0.25)
  Top 0.406: U5.4 10.42,73.37 C3.2 12.08,73.38 C5.+ 15.64,73.38 17.02,72.01 18.92,70.1 18.92,60.83 18.92,60.58 SKT1.3
  Top 0.813: 33.4,98.93 33.53,98.93 | 33.53,98.93 40.64,98.93 41.27,99.57 JP1.1 | IC2.3 21.03,106.93 28.96,106.93 | CON12.1-1 CON12.1-2 38.53,114.73 30.73,106.93 28.96,106.93 | 33.53,98.93 v28.96,98.93 28.96,105.92 28.96,106.93
  Bottom 0.813: SKT1.P$43 SKT1.3 28.19,58.42 28.96,59.18 28.96,93.98 v28.96,98.93
AIN0  (via drill 0.25 pad 0.25)
  Top 0.152: v95.63,90.3 92.96,90.3 92.46,90.81 92.46,92.54 R22.2 | R19.1 v22.73,20.32
  Bottom 0.152: v95.63,90.3 94.23,88.9 94.23,68.96 90.3,65.02 90.3,48.13 91.44,46.99 97.92,46.99 99.44,45.47 99.44,23.62 97.41,21.59 91.19,21.59 81.03,11.43 52.83,11.43 43.94,20.32 v22.73,20.32 SKT1.18 SKT1.P$58
AIN1  (via drill 0.25 pad 0.25)
  Top 0.152: v19.94,25.53 19.94,19.18 18.54,17.78 | 18.54,17.78 SKT1.19 | R20.1 v22.73,17.78 | v20.19,17.78 18.54,17.78
  Bottom 0.152: v19.94,25.53 19.94,27.18 30.61,37.85 30.61,105.16 34.67,109.22 38.1,109.22 43.43,114.55 44.45,115.57 CON3.1 | v22.73,17.78 v20.19,17.78 | SKT1.P$59 SKT1.19
AIN2  (via drill 0.25 pad 0.25)
  Top 0.152: v21.46,24.64 21.46,17.14 19.56,15.24 | 19.56,15.24 SKT1.20 | R21.1 19.56,15.24
  Bottom 0.152: v21.46,24.64 21.46,27.18 31.24,36.96 31.24,104.9 34.92,108.59 38.35,108.59 43.69,113.92 47.12,113.92 47.5,114.3 47.5,115.55 CON3.2 | SKT1.P$60 SKT1.20
GND  (via drill 0.25 pad 0.25)
  Top 0.61: SKT1.P$80 SKT1.40
  Bottom 0.152: v67.82,5.84 68.3,6.33 CON10.6 | CON10.G2 73.06,5.25 v73.66,5.84 | CON10.G3 57.22,4.25 v56.39,5.08 C20.2 | CON10.G1 64.25,18.3 v62.23,18.29
  Bottom 0.61: SKT1.1 SKT1.P$41
  pour Top: 0,0 0,125.73 109.73,125.73 109.73,0
GP0  (via drill 0.25 pad 0.25)
  Top 0.152: R16.1 96.14,73.03 | 96.14,73.03 SW2.A2 SW2.A1 | 96.14,73.03 v96.14,70.87 | v89.66,21.59 98.68,21.59 v100.58,23.5
  Bottom 0.152: v96.14,70.87 96.14,64.64 101.22,59.56 101.22,24.13 v100.58,23.5 | v89.66,21.59 88.9,21.59 80.14,12.83 80.01,12.7 53.34,12.7 44.45,21.59 13.46,21.59 12.57,22.48 12.57,24.64 13.33,25.4 SKT1.P$56 SKT1.16
GP1
  Bottom 0.152: SKT1.P$57 SKT1.17 31.24,22.86 33.78,25.4 33.78,103.89 35.94,106.05 39.88,106.05 45.21,111.38 91.82,111.38 93.47,113.03 93.47,115.52 CON1.4
GP2  (via drill 0.25 pad 0.25)
  Top 0.152: SKT1.24 92.92,22.9 R24.2 | v63.5,10.41 63.5,13.21 v62.74,13.97
  Bottom 0.152: SKT1.P$64 SKT1.24 88.14,22.86 79.25,13.97 v62.74,13.97 53.85,13.97 39.24,28.58 39.37,95.76 39.37,96.9 45.51,103.05 CON4.1 | CON10.2 63.95,9.96 v63.5,10.41
GP3
  Top 0.152: SKT1.25 92.16,24.6 R24.1
  Bottom 0.152: SKT1.P$65 SKT1.25 88.39,25.4 78.23,15.24 54.36,15.24 40,29.59 40,96.27 47.5,103.76 47.5,105.39 CON4.2
GP4
  Bottom 0.152: CON7.4 93.42,69.17 89.53,65.15 89.53,47.12 90.93,45.72 SKT1.33 SKT1.P$73
GP5
  Top 0.152: SKT1.34 67.82,48.26 63.88,52.2 63.88,71.7 LCD1.P$15
  Bottom 0.152: SKT1.34 SKT1.P$74
GP6
  Top 0.152: SKT1.35 67.94,50.8 65.41,53.34 65.41,71.68 LCD1.P$16
  Bottom 0.152: SKT1.35 SKT1.P$75
GP7
  Top 0.152: SKT1.36 68.71,53.34 66.93,55.12 66.93,71.65 LCD1.P$17
  Bottom 0.152: SKT1.36 SKT1.P$76
GP8
  Bottom 0.152: SKT1.37 SKT1.P$77
IF_SCL  (via drill 0.25)
  Top 0.152: U5.5 10.37,76.79 v10.67,77.09 | MOD1.10 R5.2 R7.2
  Bottom 0.152: v10.67,77.09 10.03,77.72 10.03,82.17 10.67,82.8 14.99,82.8 MOD1.10
IF_SDA
  Top 0.152: U5.6 9.72,77.8 10.03,78.11 10.03,82.17 10.67,82.8 14.48,82.8 15.11,82.17 15.11,80.65 15.62,80.14 17.65,80.14 MOD1.12 R4.2 R6.2
MISO1  (via drill 0.25 pad 0.25)
  Top 0.152: SKT1.14 v28.32,30.48 v41.66,30.48 | v69.34,16.51 v69.34,10.41
  Bottom 0.152: SKT1.P$54 SKT1.14 | v41.66,30.48 43.43,30.48 52.32,21.59 64.26,21.59 v69.34,16.51 | v69.34,10.41 69.34,8.16 CON10.7 | v28.32,30.48 28.32,31.5 32.51,35.69 32.51,104.39 35.43,107.31 39.12,107.31 44.45,112.65 88.14,112.65 89.41,113.92 89.41,115.55 CON1.2
MISO2
  Bottom 0.152: CON7.2 89.42,105.39 91.95,102.87 91.95,69.6 88.01,65.66 88.01,33.4 90.93,30.48 SKT1.27 SKT1.P$67
MOSI1  (via drill 0.25 pad 0.25)
  Top 0.152: SKT1.13 v31.37,33.02 v50.04,33.02 58.17,33.02 60.86,35.72 LCD1.P$13 | v65.53,10.41 65.53,13.46 62.99,16 60.45,16 v50.04,26.42
  Bottom 0.152: v31.37,33.02 33.15,34.8 33.15,104.14 35.69,106.68 39.5,106.68 44.83,112.01 90.04,112.01 91.44,113.41 91.44,115.55 CON1.3 | SKT1.P$53 SKT1.13 | CON10.3 65,9.89 v65.53,10.41 | v50.04,26.42 v50.04,33.02
MOSI2
  Bottom 0.152: CON7.3 92.71,104.12 92.71,69.34 88.77,65.41 88.77,35.18 90.93,33.02 SKT1.28 SKT1.P$68
N$1
  Top 0.152: U5.2 9.07,72.72 9.14,72.64 9.27,72.52 9.4,72.52 9.52,72.39 9.61,72.3 C4.2
  Top 0.813: R2.1 9.52,71.54 C4.2
N$2
  Top 0.152: C4.1 7.91,72.05 7.91,72.94 7.91,73.06 8.13,73.28 8.38,73.28 U5.1
  Top 0.813: R1.1 7.87,71.59 C4.1
N$3
  Top 0.152: C16.1 54.39,67.22 54.86,67.69 LCD1.P$9
N$4
  Top 0.152: LCD1.P$7 51.86,68.97 C17.1
N$5
  Top 0.152: C17.2 50.89,67.22 50.42,67.69 50.42,71.66 LCD1.P$6
N$8
  Top 0.152: LCD1.P$8 53.36,68.94 C16.2
N$10  (via drill 0.25)
  Top 0.813: D2.A 23.24,97.03 v24.38,95.89
  Bottom 0.813: MOD1.14 22.99,81.41 24.38,82.8 v24.38,95.89
N$11
  Top 0.152: LCD1.P$1 42.86,69.11 C11.1
N$12
  Top 0.152: LCD1.P$2 44.36,69.09 C12.1
N$13
  Top 0.813: 21.04,104.61 C1.1 23.73,104.5 C2.+ | 21.04,104.61 IC2.2 | 21.04,104.61 18.5,104.61 17.91,104.01 17.91,99.31 17.4,98.81 D3.A
N$14
  Top 0.813: R27.1 D2.K D3.K R29.1 10.38,100.91 T3.E
N$15
  Top 0.152: LCD1.P$3 45.86,69.06 C13.1
N$16
  Top 0.152: LCD1.P$4 47.36,69.04 C14.1
N$17
  Top 0.152: LCD1.P$5 48.86,69.02 C15.1
N$18
  Top 0.152: C18.1 56.39,71.69 LCD1.P$10
N$19
  Top 0.152: LED4.C 101.1,98.81 R11.2
N$20
  Top 0.152: LED6.C 101.1,108.97 R13.2
N$21
  Top 0.152: LED5.C 101.1,103.89 R12.2
N$22
  Top 0.152: R17.2 37.59,73.64 LCD1.A
N$24
  Top 0.152: R19.2 R20.2 R21.2 TP3.TP
N$25
  Top 0.152: R22.1 100.54,92.58 VR1.P$2
N$26  (via drill 0.25 pad 0.25)
  other vias: 46.99,30.48
N$28
  Top 0.813: T2.1 2.47,102.04 2.16,101.73 2.16,97.54 2.67,97.03 R26.1
N$29
  Top 0.813: SW3.2 21.5,119.42 20.7,118.62 12.95,118.62 9.65,115.32 9.65,103.34 T3.C
N$32
  Top 0.813: R29.2 8.67,100.46 8.67,100.91 T3.B 6.52,101.01 T2.3
PA_1
  Top 0.152: LED1.C 73.9,3.33 R8.2
PWM0-RED  (via drill 0.25 pad 0.25)  (1 unrouted)
  Top 0.152: v102.74,97.03 102.74,98.77 R11.1
  Bottom 0.152: v102.74,97.03 104.01,95.76 104.01,89.92 104.01,88.39 101.73,86.11 101.73,76.2 101.73,74.8 98.55,71.63 98.55,65.28 103.5,60.33 103.5,22.73 96.01,15.24 SKT1.21
PWM1-BLUE  (via drill 0.25 pad 0.25)
  Top 0.152: v102.74,102.23 102.7,102.27 R12.1
  Bottom 0.152: 101.09,76.45 101.09,76.96 | 101.09,76.96 101.09,86.36 103.38,88.65 103.38,89.92 103.38,95.12 101.85,96.65 101.85,100.84 102.74,101.73 v102.74,102.23 | SKT1.22 SKT1.P$62 97.54,17.78 102.74,22.99 102.74,60.07 97.92,64.9 97.92,71.88 101.09,75.06 101.09,76.96
PWM2-GREEN  (via drill 0.25 pad 0.25)
  Top 0.152: v102.74,106.93 102.74,108.93 R13.1 | SKT1.P$63 SKT1.23
  Bottom 0.152: v102.74,106.93 101.22,105.41 101.22,96.39 102.74,94.87 102.74,88.9 100.46,86.61 100.46,76.71 100.46,75.31 97.28,72.14 97.28,64.39 101.98,59.82 101.98,23.24 99.06,20.32 SKT1.23
RX1  (via drill 0.25, 0.25 pad 0.25)
  Top 0.152: CON2.1 59.48,112.57 v55.5,108.59 | SKT1.10 17.78,40.64 35.01,40.64 R23.2 36.36,40.68 37.72,42.04 37.72,44.58 37.72,54.74 v36.58,55.88 | v38.1,88.39 v55.5,105.79
  Bottom 0.152: v55.5,105.79 v55.5,108.59 | SKT1.P$50 SKT1.10 | v36.58,55.88 35.05,57.4 35.05,59.94 35.05,69.09 36.7,70.74 36.7,72.52 35.56,73.66 35.05,74.17 35.05,78.23 35.05,85.34 v38.1,88.39
RX2  (via drill 0.25 pad 0.25)
  Top 0.152: SKT1.31 v77.85,40.64 74.46,40.64 R18.2
  Bottom 0.152: CON6.1 66.98,97.92 84.07,97.92 84.96,97.03 85.09,67.82 84.2,66.8 84.2,46.99 v77.85,40.64 | SKT1.31 SKT1.P$71
SCK1  (via drill 0.25 pad 0.25)
  Top 0.152: LCD1.P$14 62.36,35.31 54.99,27.94 v43.43,27.94 v23.75,27.94 SKT1.15 | v66.29,16.51 67.31,15.49 v67.31,9.65
  Bottom 0.152: v23.75,27.94 31.88,36.07 31.88,104.65 35.18,107.95 38.73,107.95 44.07,113.28 86.49,113.28 87.42,114.22 CON1.1 | v43.43,27.94 54.86,16.51 v66.29,16.51 | SKT1.P$55 SKT1.15 | v67.31,9.65 67.31,8.2 CON10.5
SCK2
  Bottom 0.152: CON7.1 87.42,105.36 91.19,101.6 91.19,69.72 87.25,65.79 87.25,31.62 90.93,27.94 SKT1.26 SKT1.P$66
SCL  (via drill 0.25, 0.25 pad 0.25)
  Top 0.152: R15.1 77.72,88.39 | 77.72,88.39 77.72,77.98 78.61,77.09 IC5.6 | v81.03,88.39 82.11,89.48 IC4.2 84.64,89.48 85.34,88.77 85.34,85.72 JP4.4 | v78.61,88.39 77.72,88.39 | R7.1 14.86,87.25 15.88,88.27 27.94,88.27 29.97,86.23 61.09,86.23 v62.1,87.25
  Bottom 0.152: v81.03,88.39 v78.61,88.39 63.12,88.39 v62.1,87.25
SCL1  (via drill 0.25 pad 0.25)
  Top 0.152: CON5.1 73.45,108.76 69.6,104.9 69.6,84.33 | SKT1.12 53.72,35.56 v57.78,39.62 | v69.22,56.52 69.6,56.9 69.6,84.33 | v68.45,84.33 69.6,84.33
  Bottom 0.152: v57.78,39.62 69.22,51.05 v69.22,56.52 | JP4.2 v68.45,84.33 | SKT1.P$52 SKT1.12
SCL2  (via drill 0.25 pad 0.25)
  Top 0.152: v84.07,35.56 SKT1.29 | JP4.6 v89.66,84.33
  Bottom 0.152: CON8.1 73.45,104.47 78.36,99.57 88.65,99.57 89.66,98.55 v89.66,84.33 89.66,70.23 85.72,66.29 85.72,39.75 84.07,38.1 v84.07,35.56 | SKT1.29 SKT1.P$69
SDA  (via drill 0.25)
  Top 0.152: R14.1 v79.5,90.17 | v79.5,90.17 79.5,79.12 80.26,78.36 IC5.5 83.44,78.36 83.95,78.87 JP4.3 | IC4.1 79.54,90.13 v79.5,90.17 | R6.1 20.45,86.87 21.08,87.5 27.43,87.5 29.46,85.47 61.85,85.47 66.55,90.17 v67.56,90.17
  Bottom 0.152: v67.56,90.17 v79.5,90.17
SDA1  (via drill 0.25 pad 0.25)
  Top 0.152: CON5.2 75.45,109.74 70.36,104.65 70.36,81.79 | SKT1.11 v52.58,38.1 | 70.36,81.79 v70.36,55.37 | v71.5,81.79 70.36,81.79
  Bottom 0.152: v52.58,38.1 64.9,38.1 70.36,43.56 v70.36,55.37 | JP4.1 v71.5,81.79 | SKT1.P$51 SKT1.11
SDA2  (via drill 0.25 pad 0.25)
  Top 0.152: v85.72,38.1 SKT1.30 | JP4.5 v90.42,81.79
  Bottom 0.152: CON8.2 75.45,103.49 78.61,100.33 88.9,100.33 90.42,98.81 v90.42,81.79 90.42,69.98 86.49,66.04 86.36,38.73 v85.72,38.1 | SKT1.30 SKT1.P$70
TGT_CTS  (via drill 0.25 pad 0.25)
  Top 0.152: v81.91,60.96 SKT1.39 | v26.29,62.23 32,62.23 v58.55,62.23
  Bottom 0.152: SKT1.39 SKT1.P$79 | v81.91,60.96 59.82,60.96 v58.55,62.23 | MOD1.8 15.11,80.14 15.11,69.72 22.61,62.23 v26.29,62.23
TGT_NRESET
  Top 0.152: SKT1.P$46 SKT1.6 19.43,50.8 22.99,54.36 22.99,61.98 22.99,68.07 13.84,77.22 MOD1.7
TGT_RTS  (via drill 0.25 pad 0.25)
  Top 0.152: SKT1.38 91.57,59.82 v80.77,59.82 | v41.27,60.58 v27.56,60.58
  Bottom 0.152: SKT1.38 SKT1.P$78 | v41.27,60.58 58.42,60.58 59.18,59.82 v80.77,59.82 | MOD1.6 12.57,80.14 12.57,71.25 23.24,60.58 v27.56,60.58
TGT_RX
  Top 0.152: SKT1.8 20.32,45.72 24.26,49.66 24.26,50.55 24.26,60.71 24.26,68.58 18.92,73.91 18.92,76.84 MOD1.11
  Bottom 0.152: SKT1.P$48 SKT1.8
TGT_SWCLK
  Bottom 0.152: SKT1.5 SKT1.P$45 10.79,53.34 8.76,55.37 MOD1.3
TGT_SWDIO  (via drill 0.25 pad 0.25)
  Top 0.152: SKT1.4 v18.8,55.88 21.72,58.8 22.35,59.44 22.35,67.82 MOD1.5
  Bottom 0.152: SKT1.P$44 SKT1.4
TGT_TX
  Top 0.152: SKT1.7 20.32,48.26 23.62,51.56 23.62,52.32 23.62,60.71 23.62,68.33 16.38,75.56 MOD1.9
  Bottom 0.152: SKT1.P$47 SKT1.7
TX1  (via drill 0.25)
  Top 0.152: CON2.2 61.48,113.17 v36.7,88.39 | SKT1.9 17.53,42.42 21.72,42.42 21.76,42.38 R23.1 35.9,42.38 36.7,43.18 36.7,44.58 36.7,53.72 v35.56,54.86
  Bottom 0.152: SKT1.P$49 SKT1.9 | v35.56,54.86 34.42,56.01 34.42,59.94 34.42,69.34 36.07,70.99 36.07,72.26 34.42,73.91 34.42,78.23 34.42,86.11 v36.7,88.39
TX2  (via drill 0.25 pad 0.25)
  Top 0.152: SKT1.32 v81.91,43.18 81.11,42.38 R18.1
  Bottom 0.152: CON6.2 68.22,98.68 84.33,98.68 85.47,97.54 85.47,67.06 84.96,66.55 84.96,46.23 v81.91,43.18 | SKT1.32 SKT1.P$72
VCC_GROVE
  Top 0.813: 63.5,105.41 CON6.3 CON2.3 63.48,118.36 | 63.48,118.36 49.51,118.36 CON3.3 49.51,106.93 | 63.48,118.36 77.47,118.36 77.47,115.57 CON5.3 CON8.3 | 49.51,106.93 CON4.3 | JP1.2 38.73,103.76 42.04,107.06 49.39,107.06 49.51,106.93

### Text on the board
tPlace: !PWR_OFF | GND | 3v3 | SPI1 | ANALOG | UART1 | I2C1 | AIN1 | AIN2 | VCC | GND | RX | TX | VCC | GND | SCL | SDA | VCC | GND | SCK | MISO | MOSI | SEL | PWM2 | UART2 | I2C2 | SPI2 | PWM1 | DIGITAL | GP2 | GP3 | VCC | GND | RX | TX | VCC | GND | SCL | SDA | VCC | GND | SCK | SEL | MISO | MOSI | PWM0 | 3v3 | Vbus | Grove Vcc | AIN0 | LM75B | SDA | SCL | 1 | 2 | GP0 | GND | 3v3 | DAPlink | GND | GND | 3V3 | TGT_CTS | Vbus | TGT_RTS | SWDIO | GP8 | SWCLK | GP7 | nRESET | GP6 | TGT_TX | GP5 | TGT_RX | GP4 | TX1 | TX2 | RX1 | TX1/RX1 / Loopback | TX2/RX2 / Loopback | RX2 | SDA1 | SDA2 | SCL1 | SCL2 | MOSI1 | MOSI2 | MISO1 | MISO2 | SCK1 | SCK2 | GP0 | GP3 | GP2/3 / Loopback | GP1 | GP2 | AIN0 | AIN0-CI | PWM2/GREEN | AIN1 | AIN1-CI | PWM1/BLUE | AIN2 | AIN2-CI | PWM0/RED | Module Test Bed v2.0.0
bPlace: : MOSI1 | MOSI | LCD | : SCK1 | SCK | C128032A1Z | : GP5 | A0 | : GP6 | RESET | : GP7 | nCS | : GP0 | Button | : PWM2 | Red LED | : PWM1 | Green LED | : PWM0 | Blue LED | : AIN0 | Potentiometer | : SCL1/2 | SCL | Temperature | : SDA1/2 | SDA | LM75B | : 0x90 | Addr | : SCL1/2 | SCL | EEPROM | : SDA1/2 | SDA | AT24LC256 | : 0xA0 | Addr | : MOSI1 | MOSI | SD Card | : MISO1 | MISO | : SCK1 | SCK | : GP2 | nCS
TopSilkscreen: SWDIO | SWCLK | nRESET
225bmp: PWR | HID | COM | RESET